# Altium schematic sheet Analog.SchDoc
size 420 x 297 mm; CheckedBy: Глазков В.В.; Author: Митр Д.В.; SheetNumber: 1; SheetTotal: 2
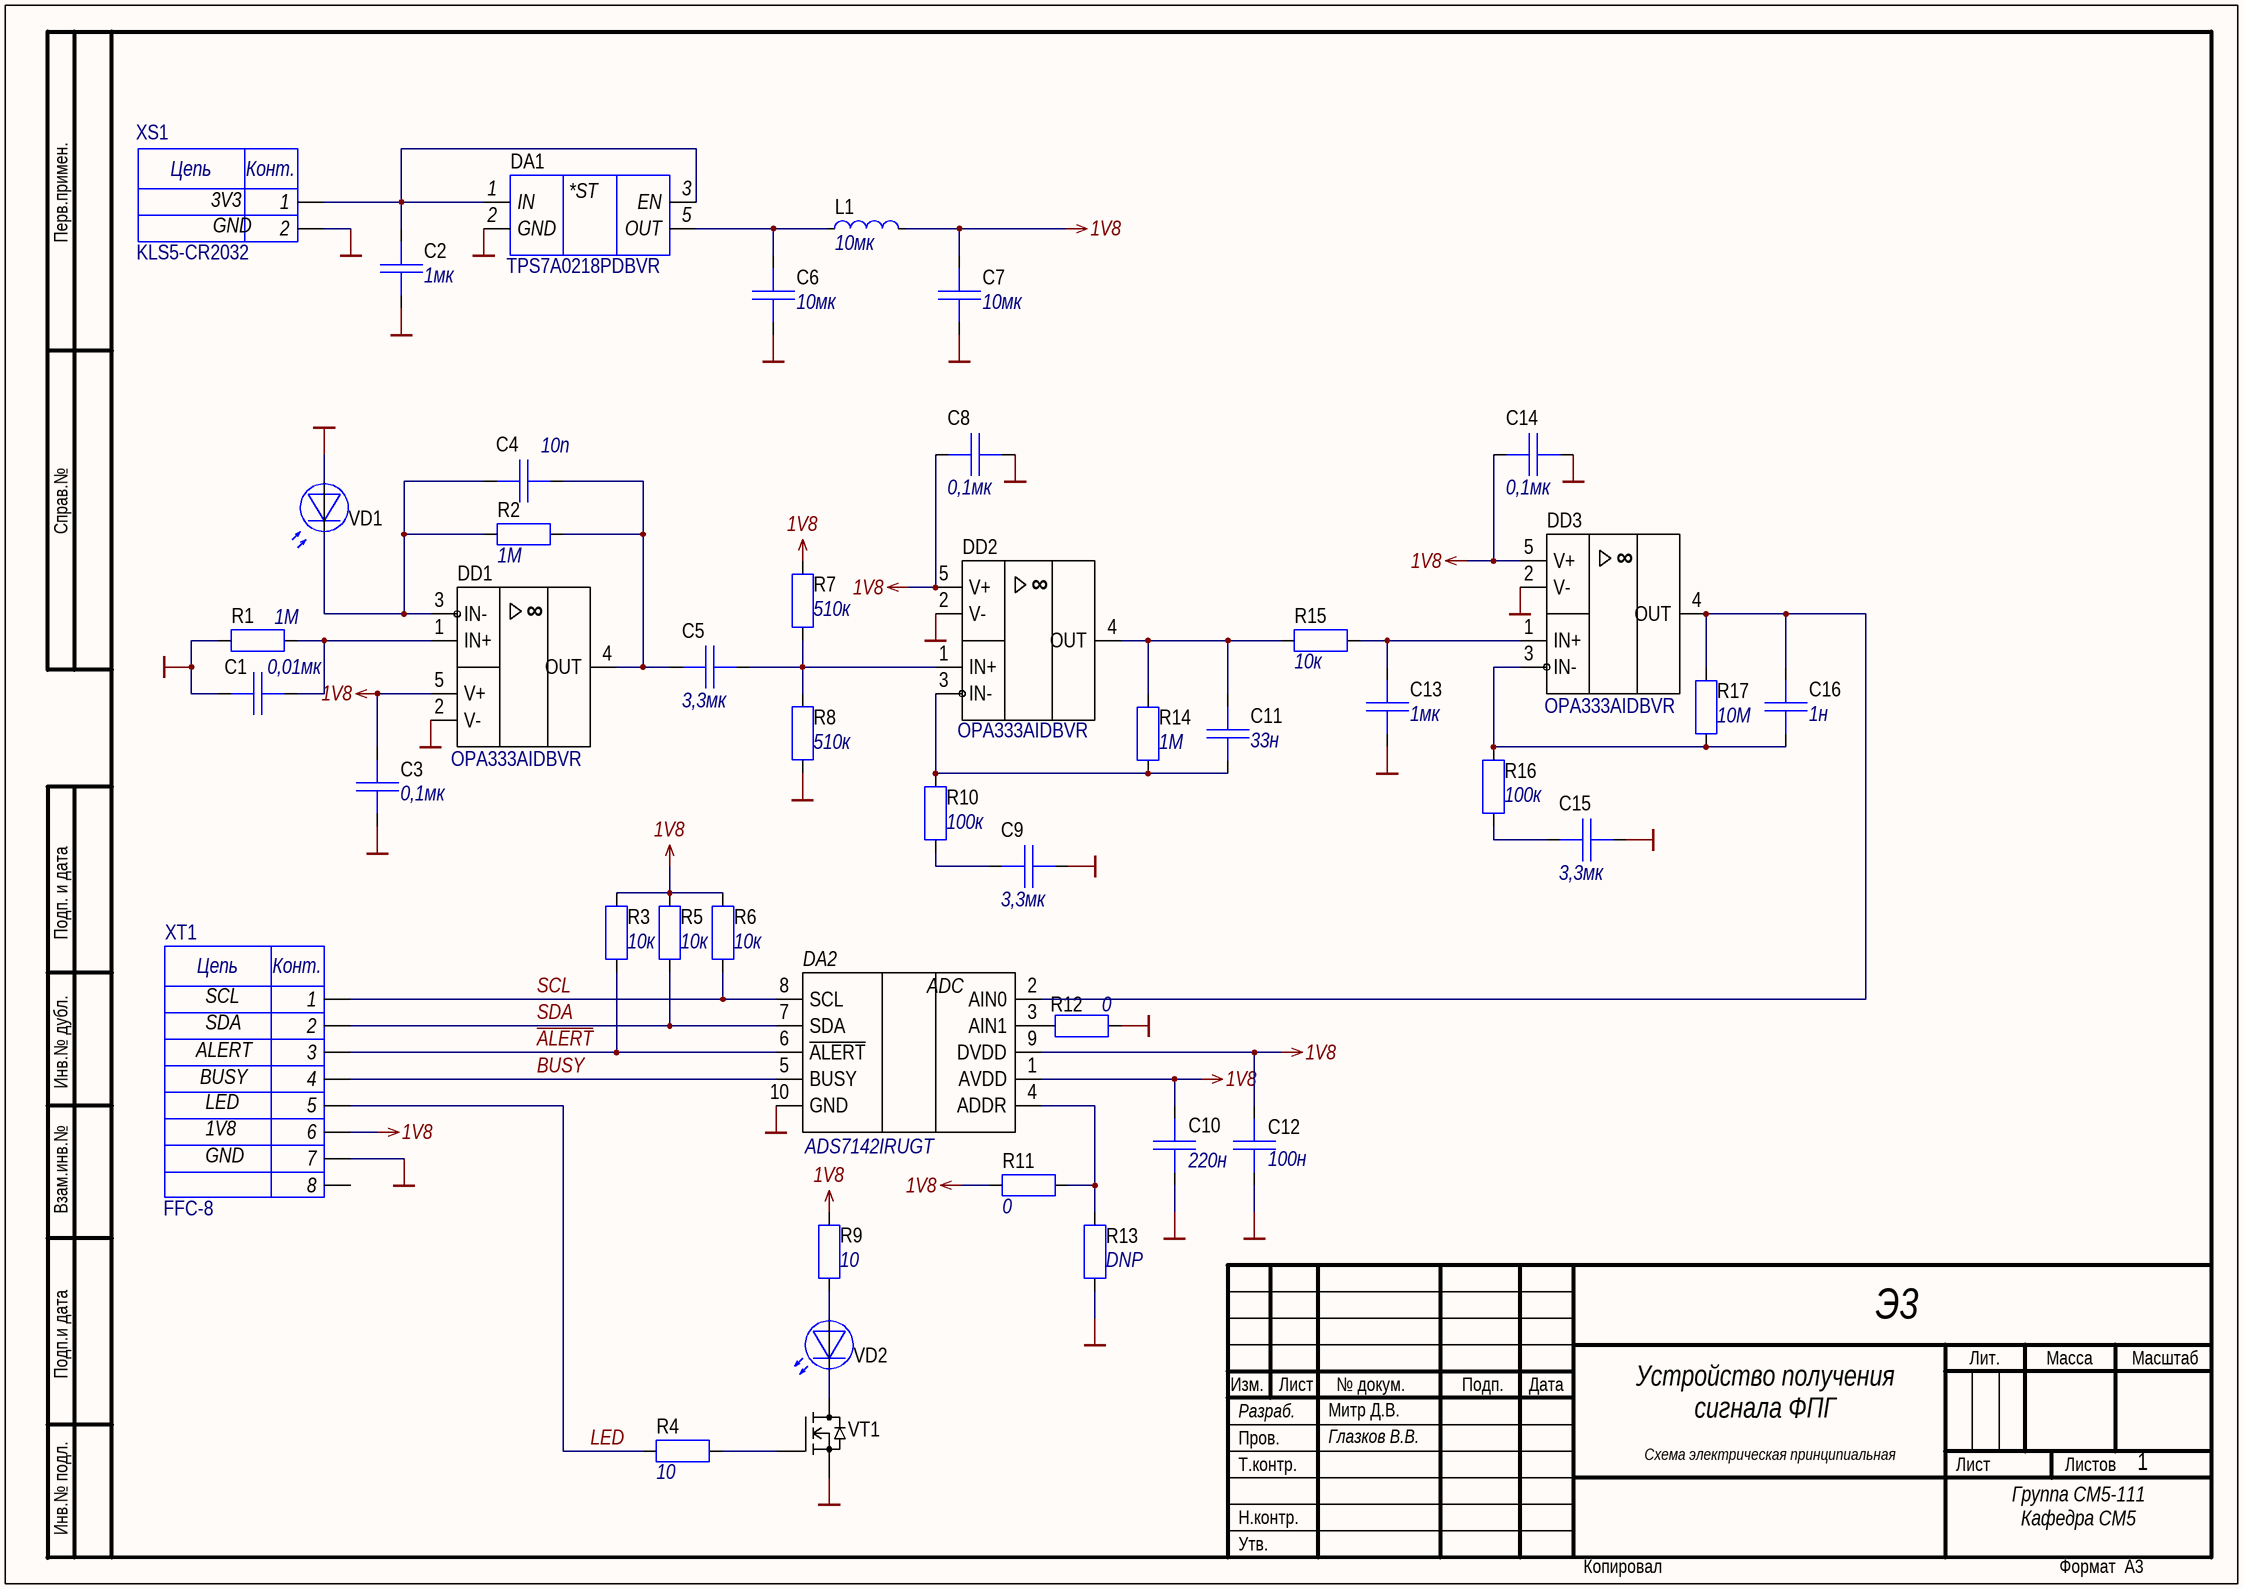
[diagram p0: Analog.SchDoc]

## Parts
C1  0,01мк  [cap0402]
C2  1мк  [cap0603]
C3  0,1мк  [cap0402]
C4  10п  [cap0402]
C5  3,3мк  [CAP0805]
C6  10мк  [cap0603]
C7  10мк  [cap0603]
C8  0,1мк  [cap0402]
C9  3,3мк  [CAP0805]
C10  220н  [cap0402]
C11  33н  [cap0402]
C12  100н  [cap0402]
C13  1мк  [cap0402]
C14  0,1мк  [cap0402]
C15  3,3мк  [CAP0805]
C16  1н  [cap0402]
DA1  name_main: TPS7A0218PDBVR  [TPS7A02]
DA2  ADC  [ADS7142IRUGT]  (value not drawn)
DD1  main_name: OPA333AIDBVR  [OPA333]  (hidden comment: operational amplifier_2)
DD2  main_name: OPA333AIDBVR  [OPA333]  (hidden comment: operational amplifier_1)
DD3  main_name: OPA333AIDBVR  [OPA333]  (hidden comment: operational amplifier_1)
L1  10мк  [MLZ1608M100WT000]
R1  1M  [RES0402]
R2  1M  [RES0402]
R3  10к  [RES0402]
R4  10  [RES0402]
R5  10к  [RES0402]
R6  10к  [RES0402]
R7  510к  [RES0402]
R8  510к  [RES0402]
R9  10  [RES0402]
R10  100к  [RES0402]
R11  0  [RES0402]
R12  0  [RES0402]
R13  DNP  [RES0402]
R14  1М  [RES0402]
R15  10к  [RES0402]
R16  100к  [RES0402]
R17  10М  [RES0402]
VD1  (no value)  [SFH2703]
VD2  (no value)  [LED1206]
VT1  RU1J002YNTCL  [Mosfet]  (value not drawn)
XS1  name_main: KLS5-CR2032  [Battery]
XT1  name_main: FFC-8  [FFC8]

## Nets
1V8: C3.2 C7.2 C8.2 C10.2 C12.2 C14.2 DA2.1(AVDD) DA2.9(DVDD) DD1.5(V+) DD2.5(V+) DD3.5(V+) L1.2 R3.1 R5.1 R6.1 R7.2 R9.2 R11.1 XT1.6
GND: C1.1 C2.1 C3.1 C6.1 C7.1 C8.1 C9.2 C10.1 C12.1 C13.1 C14.1 C15.2 DA1.2(GND) DA2.10(GND) DD1.2(V-) DD2.2(V-) DD3.2(V-) R1.1 R8.1 R12.2 R13.2 VD1.1 VT1.2(S) XS1.2 XT1.7
~{ALERT}: DA2.6(~{ALERT}) R3.2 XT1.3
BUSY: DA2.5(BUSY) XT1.4
LED: R4.2 XT1.5
SCL: DA2.8(SCL) R6.2 XT1.1
SDA: DA2.7(SDA) R5.2 XT1.2
NetC1_2: C1.2 DD1.1(IN+) R1.2
NetC2_2: C2.2 DA1.1(IN) DA1.3(EN) XS1.1
NetC4_1: C4.1 DD1.3(IN-) R2.1 VD1.2
NetC4_2: C4.2 C5.1 DD1.4(OUT) R2.2
NetC5_2: C5.2 DD2.1(IN+) R7.1 R8.2
NetC6_2: C6.2 DA1.5(OUT) L1.1
NetC9_1: C9.1 R10.2
NetC11_1: C11.1 DD2.4(OUT) R14.1 R15.2
NetC11_2: C11.2 DD2.3(IN-) R10.1 R14.2
NetC13_2: C13.2 DD3.1(IN+) R15.1
NetC15_1: C15.1 R16.2
NetC16_1: C16.1 DA2.2(AIN0) DD3.4(OUT) R17.1
NetC16_2: C16.2 DD3.3(IN-) R16.1 R17.2
NetDA2_3: DA2.3(AIN1) R12.1
NetDA2_4: DA2.4(ADDR) R11.2 R13.1
NetR4_1: R4.1 VT1.1(G)
NetR9_1: R9.1 VD2.A
NetVD2_K: VD2.K VT1.3(D)

Not connected (* = marked no-connect by the designer): XT1 8

## Notes on the sheet
- SCL
- ALERT
- SDA
- BUSY
- LED
- 1V8
- GND
- Э3
- Устройство получения
  сигнала ФПГ
- 1
- Перв.примен.
- Справ.№
- Подп. и дата
- Инв.№ дубл.
- Взам.инв.№
- Подп.и дата
- Разраб.
- Изм.
- Лист
- № докум.
- Подп.
- Дата
- Лит.
- Масса
- Масштаб
- Т.контр.
- Пров.
- Митр Д.В.
- Глазков В.В.
- Схема электрическая принципиальная
- Листов
- Инв.№ подл.
- Утв.
- Н.контр.
- Группа СМ5-111
  Кафедра СМ5
  МГТУ им Н.Э.Баумана
- Копировал
- Формат  A3
- (in symbol CR2032) Цепь; Конт.; 3V3; GND
- (in symbol FFC8) Цепь; Конт.
- (in symbol LDO) *ST
- (in symbol operational amplifier_1) ∞
- (in symbol operational amplifier_2) ∞

## Library data of the parts
C1 = CapCer: Керамический конденсатор; manufacture: ОЖО.460.107ТУ; name_main: GRM155R71C103KA01D; Units: Ф; Name: Керамический конденсатор; Value: 0,01мк
C2 C13 = CapCer: Керамический конденсатор; manufacture: ОЖО.460.107ТУ; nameSuf: -3; name_main: CC0603KRX7R7BB105; Units: Ф; Name: Керамический конденсатор; Value: 1мк
C3 C8 C14 = CapCer: Керамический конденсатор; manufacture: ОЖО.460.107ТУ; nameSuf: -3; name_main: CC0603KRX7R7BB104; Units: Ф; Name: Керамический конденсатор; Value: 0,1мк
C4 = CapCer: Керамический конденсатор; manufacture: ОЖО.460.107ТУ; name_main: CL10C100JB8NNNC; Units: Ф; Name: Керамический конденсатор; Value: 10п
C5 C9 C15 = CapCer: Керамический конденсатор; manufacture: ОЖО.460.107ТУ; name_main: GRM21BR60J335K; Units: Ф; Name: Керамический конденсатор; Value: 3,3мк
C6 C7 = CapCer: Керамический конденсатор; manufacture: ОЖО.460.107ТУ; name_main: GRM188R61E106M; Units: Ф; Name: Керамический конденсатор; Value: 10мк
C10 = CapCer: Керамический конденсатор; manufacture: ОЖО.460.107ТУ; name_main: CL10B224KA8NNNC; Units: Ф; Name: Керамический конденсатор; Value: 220н
C11 = CapCer: Керамический конденсатор; manufacture: ОЖО.460.107ТУ; nameSuf: -3; name_main: CC0603KRX7R7BB333; Units: Ф; Name: Керамический конденсатор; Value: 33н
C12 = CapCer: Керамический конденсатор; manufacture: ОЖО.460.107ТУ; name_main: GRM188R71C104KA01D; Units: Ф; Name: Керамический конденсатор; Value: 100н
C16 = CapCer: Керамический конденсатор; manufacture: ОЖО.460.107ТУ; name_main: GRM188R61C105K; Units: Ф; Name: Керамический конденсатор; Value: 1н
DA1 = LDO: name: Микросхема
DD1 = operational amplifier_2: Операционный усилитель
DD2 DD3 = operational amplifier_1: Операционный усилитель
L1 = Ind: Катушка индуктивности; Units: Гн; Name: Катушка индуктивности; name_main: MLZ1608M100WT000; Value: 10мк
R1 R14 = Res: Резистор; Manufacturer: АЛЯР.434110.005ТУ; Tolerance: 1%; name_main: RC0603FR-071ML; Name: Резистор
  R1: Value: 1M
  R14: Value: 1М
R2 = Res: Резистор; Manufacturer: АЛЯР.434110.005ТУ; name_main: RC0603FR-071ML; Name: Резистор; Value: 1M
R3 R5 R6 R15 = Res: Резистор; Manufacturer: АЛЯР.434110.005ТУ; Tolerance: 5%; name_main: RC0603FR-0710KL; Name: Резистор; Value: 10к
R4 R9 = Res: Резистор; Manufacturer: АЛЯР.434110.005ТУ; Tolerance: 5%; name_main: RC0603JR-0710RL; Name: Резистор; Value: 10
R7 R8 = Res: Резистор; Manufacturer: АЛЯР.434110.005ТУ; name_main: RC0603FR-07510KL; Name: Резистор; Value: 510к
R10 R16 = Res: Резистор; Manufacturer: АЛЯР.434110.005ТУ; name_main: RC0603FR-07100KL; Name: Резистор; Value: 100к
R11 R12 = Res: Резистор; Manufacturer: АЛЯР.434110.005ТУ; Tolerance: 5%; name_main: RC0603FR-070RL; Name: Резистор; Value: 0
R13 = Res: Резистор; Manufacturer: АЛЯР.434110.005ТУ; Tolerance: 5%; name_main: Р1-12-0,1-; Value: 0; Name: Резистор
R17 = Res: Резистор; Manufacturer: АЛЯР.434110.005ТУ; name_main: RC0603FR-0710ML; Name: Резистор; Value: 10М
VD1 = Photodiode: manufacture: аА0.339.189ТУ; Name: Индикатор; Name_main: 3Л341Б
VD2 = Led: Излучатель; manufacture: аА0.339.189ТУ; Name: Индикатор; Name_main: 15412094A9000
VT1 = RU1J002YNTCL: N-MOSFET DirectFET SQ
XS1 = CR2032: manufacture: БСАР.430420.014ТУ; name: Разъемы
XT1 = FFC8: manufacture: 2328702-8; name: Разъемы
DA2 = ADC: main_name: ADS7142IRUGT